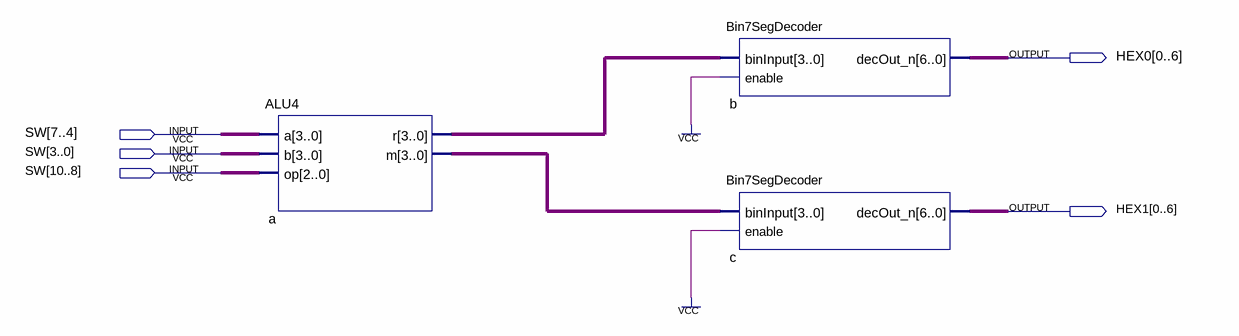
[diagram p0: schematic sheet]
// Quartus schematic ALUDemo.bdf as structural Verilog: 3 symbols, 5 pins
module ALUDemo (
  input  [10:0] SW,
  output [0:6] HEX0,
  output [0:6] HEX1
);

  wire [3:0] a_m, a_r;

  ALU4 a (.a(SW[7:4]), .b(SW[3:0]), .op(SW[10:8]), .r(a_r), .m(a_m));
  Bin7SegDecoder b (.binInput(a_r), .enable(1'b1), .decOut_n(HEX0));
  Bin7SegDecoder c (.binInput(a_m), .enable(1'b1), .decOut_n(HEX1));
endmodule
